# EAGLE design HEBreakoutrev3 (EAGLE 9.6.2)
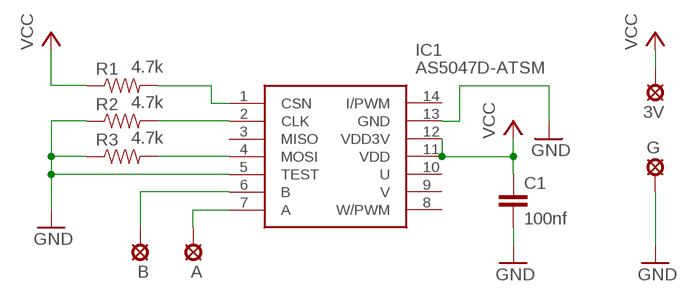
[diagram p0: schematic, sheet 1]

## Parts
3V  LSP10  [LSP10]
A  LSP10  [LSP10]
B  LSP10  [LSP10]
C1  100nf  CAP0603-CAP  [0603-CAP]
G  LSP10  [LSP10]
IC1  AS5047D-ATSM  [SOP65P640X120-14N]
R1  4.7k  RESISTOR0603  [0603-RES]
R2  4.7k  RESISTOR0603  [0603-RES]
R3  4.7k  RESISTOR0603  [0603-RES]

## Nets
GND: C1.2 G.MP IC1.5(TEST) IC1.13(GND) R2.1 R3.1
N$1: IC1.1(CSN) R1.2
N$2: IC1.2(CLK) R2.2
N$3: IC1.4(MOSI) R3.2
N$4: B.MP IC1.6(B)
N$5: A.MP IC1.7(A)
VCC: 3V.MP C1.1 IC1.11(VDD) IC1.12(VDD3V) R1.1
Unconnected: IC1.3(MISO) IC1.8(W/PWM) IC1.9(V) IC1.10(U) IC1.14(I/PWM)

## Library data of the parts
3V A B G = solpad:LSP10: SOLDER PAD drill 1.0 mm, distributor Buerklin, 12H555
C1 = HyTechDevices:CAP: Capacitor Standard 0603 ceramic capacitor, and 0.1" leaded capacitor.
IC1 = AS5047D-ATSM:AS5047D-ATSM: ams AS5047D-ATSM Hall Effect Sensor 14-Pin TSSOP, 3 3.6 V, 4.5 5.5 V Source: Datasheet <http://ams.com/eng/content/download/595083/1609657/320155>; ARROW_PART_NUMBER: AS5047D-ATSM; ARROW_PRICE-STOCK: https://www.arrow.com/en/products/as5047d-atsm/ams-ag; DESCRIPTION: ams AS5047D-ATSM Hall Effect Sensor 14-Pin TSSOP, 3 3.6 V, 4.5 5.5 V; HEIGHT: 1.2mm; MANUFACTURER_NAME: ams; MANUFACTURER_PART_NUMBER: AS5047D-ATSM; MOUSER_PART_NUMBER: 985-AS5047D-ATSM; MOUSER_PRICE-STOCK: https://www.mouser.co.uk/ProductDetail/ams/AS5047D-ATSM?qs=qEcPHXRbv51jEdbehV7Mjw%3D%3D
R1-R3 = HyTechDevices:RESISTOR: Resistor Basic schematic elements and footprints for 0603, 1206, and PTH resistors.

## Board
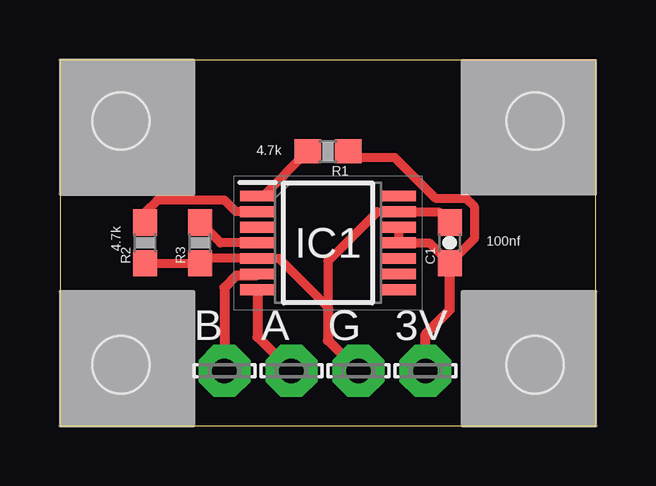
[diagram p1: board, top side]
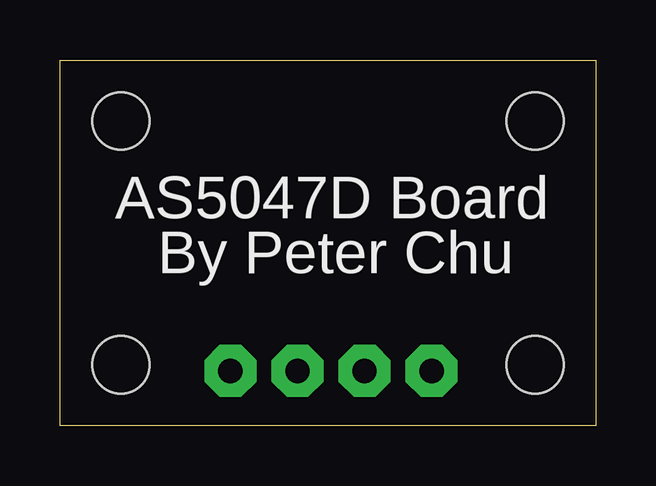
[diagram p2: board, bottom side, seen from below]

Size 22.35 x 15.24 mm. Coordinates in mm from the lower left corner, seen from the top.
Outline: 0,0 22.35,0 22.35,15.24 0,15.24 0,0
Copper layers (1*16): Top 0.035mm / dielectric 1.5mm / Bottom 0.035mm
Design rules "default": minimum track width 6mil, minimum drill 0.35mm, track to track 6mil, track to pad 6mil, pad to pad 6mil, via to via 6mil, smd to smd 6mil, copper to edge 40mil, drill to drill 6mil, minimum pad ring 10mil, minimum via ring 8mil, stop-mask expansion 4mil, vias tented up to drill 0mil, thermal gap 10mil
Holes 2.39 mm at 2.54,2.54 19.81,2.54 19.81,12.7 2.54,12.7

### Footprints (pad centres in the part's own frame; a part is rotated, then mirrored left to right if it is on the bottom)
LSP10 = drill 1.016 pad 2.159 octagon: MP 0,0
0603-CAP = smd 1.1 x 1: 1 -0.85,0; 2 0.85,0
SOP65P640X120-14N = smd 1.475 x 0.45: 1 -2.938,1.95; 2 -2.938,1.3; 3 -2.938,0.65; 4 -2.938,0; 5 -2.938,-0.65; 6 -2.938,-1.3; 7 -2.938,-1.95; 8 2.938,-1.95; 9 2.938,-1.3; 10 2.938,-0.65; 11 2.938,0; 12 2.938,0.65; 13 2.938,1.3; 14 2.938,1.95
0603-RES = smd 1.1 x 1: 1 -0.85,0; 2 0.85,0

### Placement (x,y rotation side)
3V  15.24,2.29 0 top
A  9.65,2.29 0 top
B  6.86,2.29 0 top
C1  16.26,7.62 90 top
G  12.45,2.29 0 top
IC1  11.18,7.62 0 top
R1  11.18,11.43 180 top
R2  3.56,7.62 90 top
R3  5.84,7.62 90 top

### Tracks (layer width: path | path; a pad name or v marks a point on that pad's centre or on a via)
GND
  Top 0.381: C1.2 15.84,8.89 14.14,8.89 IC1.13 13.24,8.92 11.18,6.86 11.18,4.94 9.14,6.97 IC1.5 6.04,6.97 R3.1 R2.1
  Top 0.406: 11.18,4.94 11.18,3.56 G.MP
N$1
  Top 0.381: R1.2 8.47,9.57 IC1.1
N$2
  Top 0.381: IC1.2 7.34,8.92 6.86,9.4 4.06,9.4 3.56,8.89 R2.2
N$3
  Top 0.381: R3.2 6.69,7.62 IC1.4
N$4
  Top 0.406: IC1.6 8.17,6.25 7.35,6.25 6.86,5.75 B.MP
N$5
  Top 0.406: IC1.7 8.24,3.7 A.MP
VCC
  Top 0.381: IC1.12 IC1.11 15.41,7.62 C1.1 17.27,7.79 17.27,9.14 16.93,9.48 15.66,9.48 13.97,11.18 12.28,11.18 R1.1
  Top 0.406: 3V.MP 15.24,3.81 16.26,4.83 C1.1

### Text on the board
bPlace: AS5047D Board | By Peter Chu